# Altium schematic sheet Main.SchDoc: Main
size A4; Engineer: CT; SheetNumber: 1; SheetTotal: 5
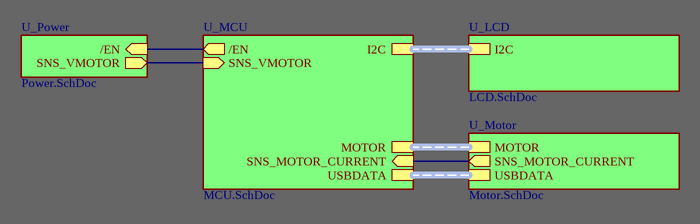
[diagram p0: Main.SchDoc]

## Sub-sheets
U_LCD = LCD.SchDoc: I2C (harness I2C)
U_MCU = MCU.SchDoc: I2C (harness I2C), MOTOR (harness MOTOR), /EN (out), SNS_MOTOR_CURRENT (in), SNS_VMOTOR (in), USBDATA (harness USBDATA)
U_Motor = Motor.SchDoc: MOTOR (harness MOTOR), SNS_MOTOR_CURRENT (out), USBDATA (harness USBDATA)
U_Power = Power.SchDoc: /EN (in), SNS_VMOTOR (out)

## Nets
(unnamed): sheet U_MCU//EN, sheet U_Power//EN
(unnamed): sheet U_MCU/SNS_MOTOR_CURRENT, sheet U_Motor/SNS_MOTOR_CURRENT
(unnamed): sheet U_MCU/SNS_VMOTOR, sheet U_Power/SNS_VMOTOR

## Buses and harness runs
harness sheet U_LCD/I2C = sheet U_MCU/I2C
harness sheet U_MCU/MOTOR = sheet U_Motor/MOTOR
harness sheet U_MCU/USBDATA = sheet U_Motor/USBDATA

## Notes on the sheet
- Title
- Link:
- Size:
- Project:
- Engineer:
- A4
- Date:
- Revision:
- Sheet
- of
- File: